# Altium project Bluetooth_NRF.PrjPCB
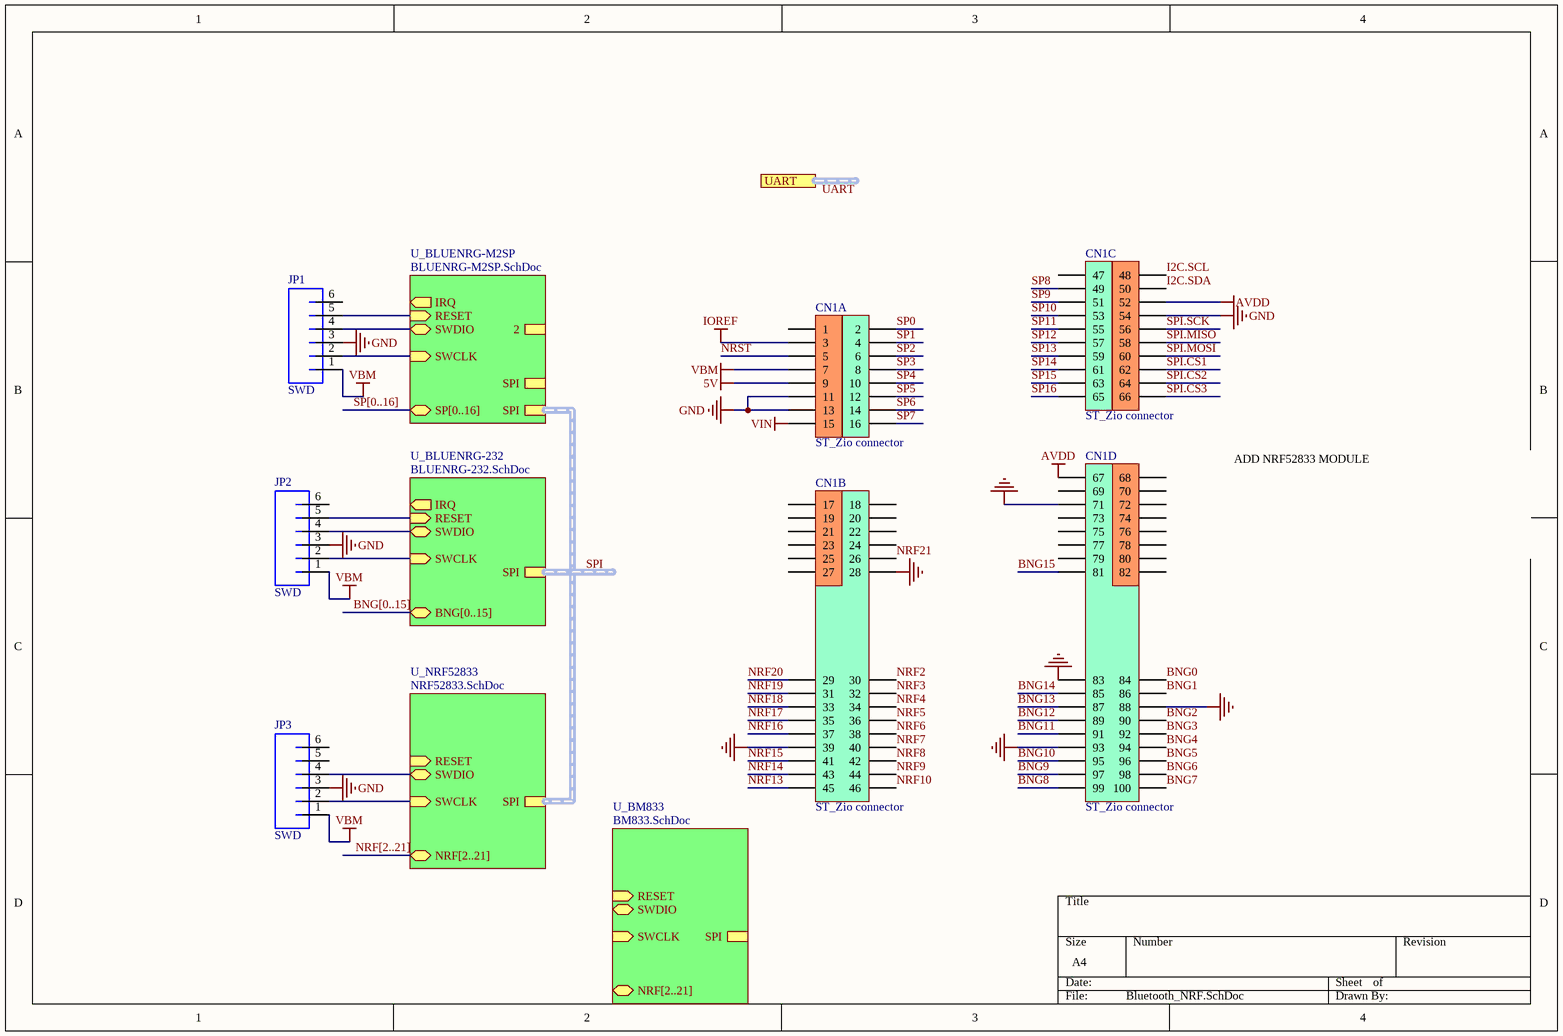
[diagram p0: Bluetooth_NRF.SchDoc]
3 sheets, 29 parts. Net scope: hierarchical (ports join the sheet entries above them; power ports are global).
Board file: Bluetooth_NRF.PcbDoc
Sheets:
  Bluetooth_NRF.SchDoc
    U_NRF52833 = NRF52833.SchDoc
    U_BM833 = BM833.SchDoc

## Sheet Bluetooth_NRF.SchDoc
size A4

### Parts
CN1  ST_Zio connector  [ST_Zio]  (parts A,B,C,D of 4)
JP1  SWD  [MOLEX_5045_6]
JP2  SWD  [MOLEX_5045_6]
JP3  SWD  [MOLEX_5045_6]

### Sub-sheets
U_BLUENRG-232 = BLUENRG-232.SchDoc (file not in this document): BNG[0..15] (bidir), IRQ (out), RESET (in), SWCLK (in), SWDIO (bidir), SPI (harness SPI)
U_BLUENRG-M2SP = BLUENRG-M2SP.SchDoc (file not in this document): IRQ (out), RESET (in), 2, SWCLK (in), SWDIO (bidir), SPI, SPI (harness SPI), SP[0..16] (bidir)
U_BM833 = BM833.SchDoc: NRF[2..21] (bidir), RESET (in), SWCLK (in), SWDIO (bidir), SPI (harness SPI)
U_NRF52833 = NRF52833.SchDoc: NRF[2..21] (bidir), RESET (in), SWCLK (in), SWDIO (bidir), SPI (harness SPI)

### Ports
UART (harness USART2)

### Nets
5V: CN1.9
AVDD: CN1.52 CN1.67
GND: CN1.11 CN1.13 CN1.28 CN1.39 CN1.54 CN1.71 CN1.83 CN1.88 CN1.93 JP1.3 JP2.3 JP3.3
IOREF: CN1.3
VBM: CN1.7 JP1.1 JP2.1 JP3.1
VIN: CN1.15
BNG0: CN1.84
BNG1: CN1.86
BNG2: CN1.90
BNG3: CN1.92
BNG4: CN1.94
BNG5: CN1.96
BNG6: CN1.98
BNG7: CN1.100
BNG8: CN1.99
BNG9: CN1.97
BNG10: CN1.95
BNG11: CN1.91
BNG12: CN1.89
BNG13: CN1.87
BNG14: CN1.85
BNG15: CN1.81
I2C.SCL: CN1.48
I2C.SDA: CN1.50
NRF2: CN1.30
NRF3: CN1.32
NRF4: CN1.34
NRF5: CN1.36
NRF6: CN1.38
NRF7: CN1.40
NRF8: CN1.42
NRF9: CN1.44
NRF10: CN1.46
NRF13: CN1.45
NRF14: CN1.43
NRF15: CN1.41
NRF16: CN1.37
NRF17: CN1.35
NRF18: CN1.33
NRF19: CN1.31
NRF20: CN1.29
NRF21: CN1.26
NRST: CN1.5
SP0: CN1.2
SP1: CN1.4
SP2: CN1.6
SP3: CN1.8
SP4: CN1.10
SP5: CN1.12
SP6: CN1.14
SP7: CN1.16
SP8: CN1.49
SP9: CN1.51
SP10: CN1.53
SP11: CN1.55
SP12: CN1.57
SP13: CN1.59
SP14: CN1.61
SP15: CN1.63
SP16: CN1.65
SPI.CS1: CN1.62
SPI.CS2: CN1.64
SPI.CS3: CN1.66
SPI.MISO: CN1.58
SPI.MOSI: CN1.60
SPI.SCK: CN1.56
NetJP1_2: JP1.2 ; sheet U_BLUENRG-M2SP/SWCLK
NetJP1_4: JP1.4 ; sheet U_BLUENRG-M2SP/SWDIO
NetJP1_5: JP1.5 ; sheet U_BLUENRG-M2SP/RESET
NetJP2_2: JP2.2 ; sheet U_BLUENRG-232/SWCLK
NetJP2_4: JP2.4 ; sheet U_BLUENRG-232/SWDIO
NetJP2_5: JP2.5 ; sheet U_BLUENRG-232/RESET
NetJP3_2: JP3.2 ; sheet U_NRF52833/SWCLK
NetJP3_4: JP3.4 ; sheet U_NRF52833/SWDIO

Not connected (* = marked no-connect by the designer): CN1 1 17 18 19 20 21 22 23 24 25 27 47 68 69 70 72 73 74 75 76 77 78 79 80 82; JP1 6; JP2 6; JP3 5 6

### Buses and harness runs
bus BNG[0..15] = sheet U_BLUENRG-232/BNG[0..15]
bus NRF[2..21] = sheet U_NRF52833/NRF[2..21]
bus SP[0..16] = sheet U_BLUENRG-M2SP/SP[0..16]
harness SPI = sheet U_BLUENRG-232/SPI = sheet U_BLUENRG-M2SP/SPI = sheet U_NRF52833/SPI
harness UART = port UART

### Notes on the sheet
- ADD NRF52833 MODULE

### Library data of the parts
JP1-JP3 = MOLEX_5045_6: PartNumber: B6B-PH-K-S(LF)(SN); Manufacturer: JST Sales America Inc.; PackageReference: JST-PH; Mounting Technology: Through Hole

## Sheet NRF52833.SchDoc
size A4
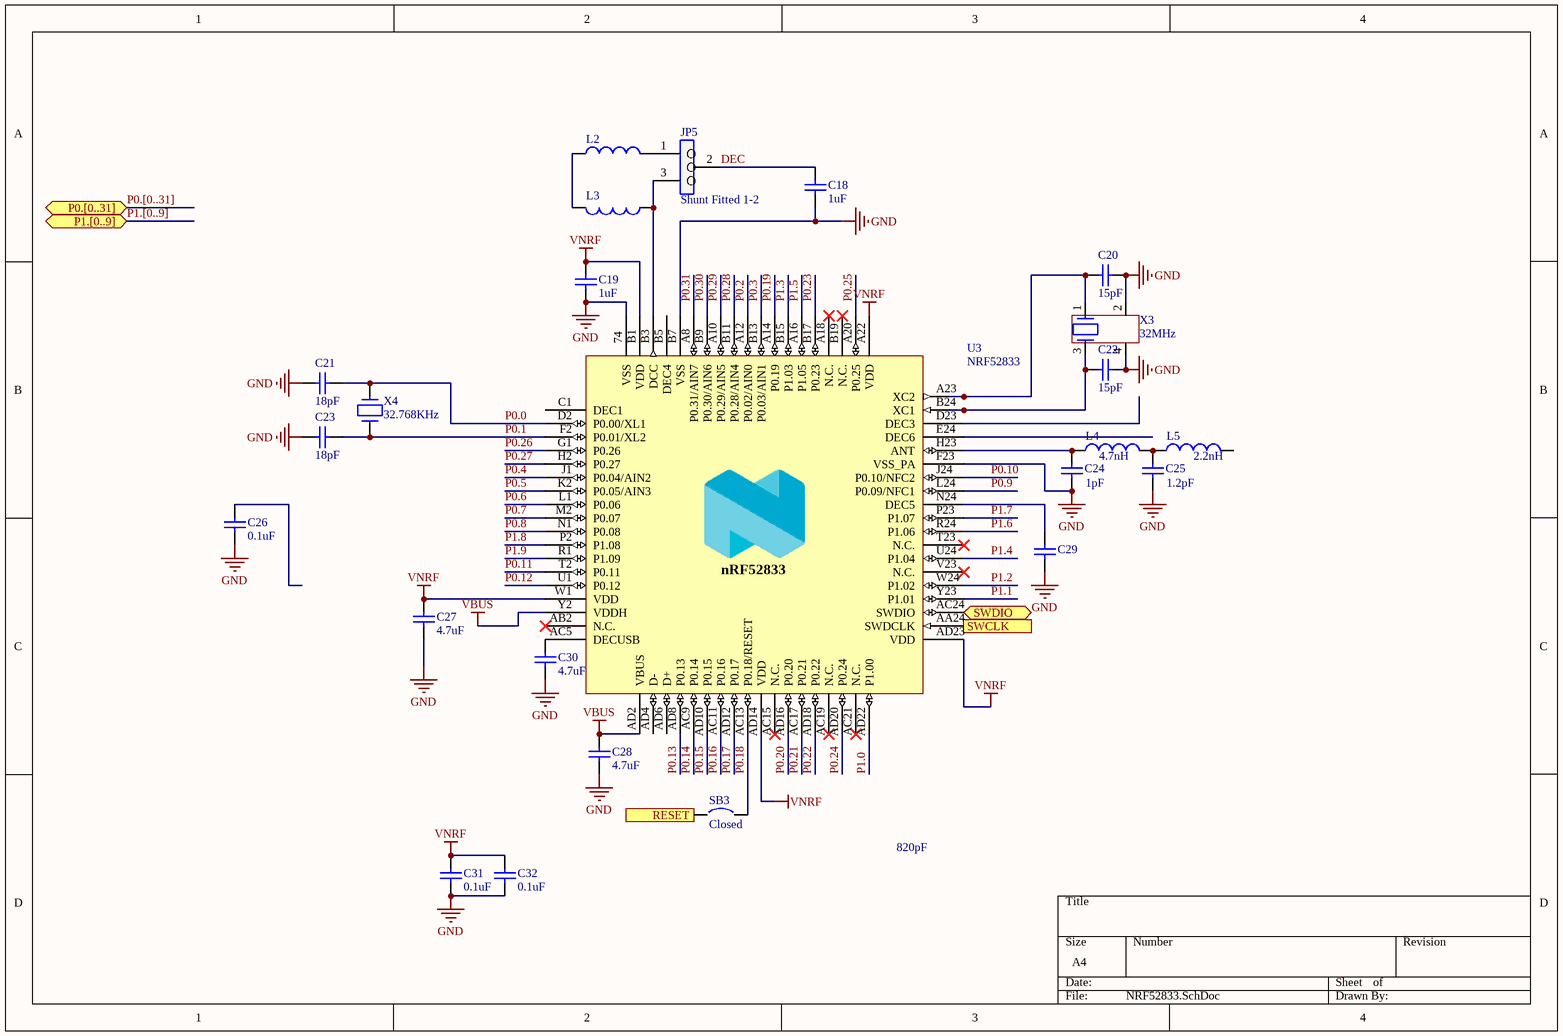
[diagram p1: NRF52833.SchDoc]

### Parts
C18  value 1uF  [C0603[1608X92]]  (hidden comment: 1uF 6.3V 0603)
C19  value 1uF  [C0603[1608X92]]  (hidden comment: 1uF 6.3V 0603)
C20  value 15pF  [C0603[1608X92]]  (hidden comment: 15pF 50V 0603)
C21  value 18pF  [C0603[1608X92]]  (hidden comment: 18pF 50V 0603)
C22  value 15pF  [C0603[1608X92]]  (hidden comment: 15pF 50V 0603)
C23  value 18pF  [C0603[1608X92]]  (hidden comment: 18pF 50V 0603)
C24  CAPACITOR 0603  [C0603[1608X92]]  (value not drawn)
C25  CAPACITOR 0603  [C0603[1608X92]]  (value not drawn)
C26  value 0.1uF  [C0603[1608X92]]  (hidden comment: 0.1uF 16V 0603)
C27  value 4.7uF  [C0603[1608X92]]  (hidden comment: 4.7uF 16V 0603)
C28  value 4.7uF  [C0603[1608X92]]  (hidden comment: 4.7uF 16V 0603)
C29  CAPACITOR 0603  [C0603[1608X92]]  (value not drawn)
C30  value 4.7uF  [C0603[1608X92]]  (hidden comment: 4.7uF 16V 0603)
C31  value 0.1uF  [C0603[1608X92]]  (hidden comment: 0.1uF 16V 0603)
C32  value 0.1uF  [C0603[1608X92]]  (hidden comment: 0.1uF 16V 0603)
JP5  value Shunt Fitted 1-2  [HDR1X3]  (hidden comment: Jumper_Header 3x1 Fitted 1-2)
L2  INDUCTOR 0603  [IND0603]  (value not drawn)
L3  INDUCTOR 0603  [IND0603]  (value not drawn)
L4  INDUCTOR 0603  [IND0603]  (value not drawn)
L5  INDUCTOR 0603  [IND0603]  (value not drawn)
SB3  Closed  [SB_0603]
U3  NRF52833  [AQFN-73]
X3  value 32MHz  [4-SMD]  (hidden comment: NX2016SA 32MHz)
X4  value 32.768KHz  [2-SMD]  (hidden comment: NX3215SA 32.768KHz)

### Ports
P0.[0..31] (bidir), P1.[0..9] (bidir), RESET (in), SWCLK (in), SWDIO (bidir)

### Nets
GND: C18.1 C19.1 C20.1 C21.2 C22.1 C23.2 C24.1 C25.1 C26.2 C27.1 C28.1 C29.1 C30.1 C31.2 C32.2 U3.74(VSS) U3.B7(VSS) U3.F23(VSS_PA) X3.2 X3.4
VBUS: C28.2 U3.AD2(VBUS) U3.Y2(VDDH)
VNRF: C19.2 C27.2 C31.1 C32.1 U3.A22(VDD) U3.AD14(VDD) U3.AD23(VDD) U3.B1(VDD) U3.W1(VDD)
DEC: C18.2 JP5.2
P0.0: C21.1 U3.D2(P0.00/XL1) X4.2(X2)
P0.1: C23.1 U3.F2(P0.01/XL2) X4.1(X1)
P0.2: U3.A12(P0.02/AIN0)
P0.3: U3.B13(P0.03/AIN1)
P0.4: U3.J1(P0.04/AIN2)
P0.5: U3.K2(P0.05/AIN3)
P0.6: U3.L1(P0.06)
P0.7: U3.M2(P0.07)
P0.8: U3.N1(P0.08)
P0.9: U3.L24(P0.09/NFC1)
P0.10: U3.J24(P0.10/NFC2)
P0.11: U3.T2(P0.11)
P0.12: U3.U1(P0.12)
P0.13: U3.AD8(P0.13)
P0.14: U3.AC9(P0.14)
P0.15: U3.AD10(P0.15)
P0.16: U3.AC11(P0.16)
P0.17: U3.AD12(P0.17)
P0.18: SB3.2 U3.AC13(P0.18/RESET)
P0.19: U3.A14(P0.19)
P0.20: U3.AD16(P0.20)
P0.21: U3.AC17(P0.21)
P0.22: U3.AD18(P0.22)
P0.23: U3.B17(P0.23)
P0.24: U3.AD20(P0.24)
P0.25: U3.A20(P0.25)
P0.26: U3.G1(P0.26)
P0.27: U3.H2(P0.27)
P0.28: U3.B11(P0.28/AIN4)
P0.29: U3.A10(P0.29/AIN5)
P0.30: U3.B9(P0.30/AIN6)
P0.31: U3.A8(P0.31/AIN7)
P1.0: U3.AD22(P1.00)
P1.1: U3.Y23(P1.01)
P1.2: U3.W24(P1.02)
P1.3: U3.B15(P1.03)
P1.4: U3.U24(P1.04)
P1.5: U3.A16(P1.05)
P1.6: U3.R24(P1.06)
P1.7: U3.P23(P1.07)
P1.8: U3.P2(P1.08)
P1.9: U3.R1(P1.09)
NetC20_2: C20.2 U3.A23(XC2) X3.1
NetC22_2: C22.2 U3.B24(XC1) X3.3
NetC24_2: C24.2 L4.1 U3.H23(ANT)
NetC25_2: C25.2 L4.2 L5.1
NetC29_2: C29.2 U3.N24(DEC5)
NetC30_2: C30.2 U3.AC5(DECUSB)
NetJP3_2: U3.AA24(SWDCLK) ; port SWCLK
NetJP3_4: U3.AC24(SWDIO) ; port SWDIO
NetJP5_1: JP5.1 L2.2
NetJP5_3: JP5.3 L3.1 U3.B3(DCC)
NetL2_1: L2.1 L3.2
NetSB3_1: SB3.1 ; port RESET

Not connected (* = marked no-connect by the designer): C26 1; L5 2; U3 A18(N.C.)* AB2(N.C.)* AC15(N.C.)* AC19(N.C.)* AC21(N.C.)* AD4(D-) AD6(D+) B5(DEC4) B19(N.C.)* C1(DEC1) D23(DEC3) E24(DEC6) T23(N.C.)* V23(N.C.)*

### Buses and harness runs
bus P0.[0..31] = port P0.[0..31]
bus P1.[0..9] = port P1.[0..9]

### Notes on the sheet
- (near C24) 1pF
- (near L4) 4.7nH
- (near C25) 1.2pF
- (near L5) 2.2nH
- 820pF
- (in symbol NRF52833) nRF52833

### Library data of the parts
C18 C19 = CAP_1uF_6.3V_0603_10%: 1uF 6.3V 10% 0603 (1608 Metric); PartNumber: GRM188R60J105KA01D; Manufacturer: Murata; TemperatureCoefficient: X5R; Mounting Technology: Surface Mount; PackageReference: 0603; PackageDescription: 0603 (1608 Metric); Voltage: 6.3V; Tolerance: 10%
C20 C22 = CAP_15pF_50V_0603_1%: 15pF 50V 1% 0603 (1608 Metric); PartNumber: 06035A150FAT2A; Manufacturer: AVX Corporation; TemperatureCoefficient: C0G; Mounting Technology: Surface Mount; PackageReference: 0603; PackageDescription: 0603 (1608 Metric); Voltage: 50V; Tolerance: 1%
C21 C23 = CAP_18pF_50V_0603_1%: 18pF 50V 1% 0603 (1608 Metric); PartNumber: 06035A180FAT2A; Manufacturer: AVX Corporation; TemperatureCoefficient: C0G; Mounting Technology: Surface Mount; PackageReference: 0603; PackageDescription: 0603 (1608 Metric); Voltage: 50V; Tolerance: 1%
C24 C25 C29 = CAP 0603: Empty CAPACITOR 0603 (1608 Metric); Mounting Technology: Surface Mount; PackageReference: 0603; PackageDescription: 0603 (1608 Metric)
C26 C31 C32 = CAP_0.1uF_16V_0603_10%: 0.1uF 16V 10% 0603 (1608 Metric); PartNumber: GCM188R71C104KA37D; Manufacturer: Murata; TemperatureCoefficient: X7R; Mounting Technology: Surface Mount; PackageReference: 0603; PackageDescription: 0603 (1608 Metric); Voltage: 16V; Tolerance: 10%
C27 C28 C30 = CAP_4.7uF_16V_0603_10%: 4.7uF 16V 10% 0603 (1608 Metric); PartNumber: GRM188R61A475KE15D; Manufacturer: Murata; TemperatureCoefficient: X5R; Mounting Technology: Surface Mount; PackageReference: 0603; PackageDescription: 0603 (1608 Metric); Voltage: 16V; Tolerance: 10%
JP5 = Jumper_Header 3x1 Fitted 1-2: Header, 3x1, 2,54mm, VR, TH, Height 5.84mm/2.54mm - Shunt Fitted 1-2 by default; Internal_Part_Number: MCD-00684; Part_Type: Connector; Manufacturer_Part_Number: TSW-103-07-F-S; Manufacturer: SAMTEC; Provided_By: SUBCO; Status: Released; ComponentLink1Description: Datasheet; ComponentLink1URL: http://tunmcdsvn.tun.st.com/Component_Datasheet_Library/Trunk/Connectors/Samtec_TSW-HTSW-series; ECCN_US: n/a; ECCN_EU: n/a
L2-L5 = IND 0603: Empty INDUCTOR 0603; PackageReference: 0603; PackageDescription: 0603 (1608 metric); Mounting Technology: Surface Mount
SB3 = Circuit Breaker_close: Circuit Breaker; Published: 24-Mar-1999; Revision: July-2002: Re-released for DXP Platform.; Publisher: Altium Limited
U3 = NRF52833: Multi-protocol Bluetooth Low Energy, IEEE 802.15.4, ANT and 2.4GHz proprietary system-on-chip; PartNumber: nRF52833-QIAA; Manufacturer: Nordic Semiconductor; PackageReference: AQFN-73; Mounting Technology: Surface Mount
X3 = NX2016SA 32MHz: Crystal 32MHz, 6pF, +-10ppm, 60ohms max, SMD; PartNumber: NX2016SA-32MHZ-EXS00A-CS07977; Manufacturer: NDK; Mounting Technology: Surface Mount; PackageReference: 4-SMD; Type: Crystal_Osc
X4 = NX3215SA 32.768KHz: Crystal 32.768kHz, 6pF, +-20ppm, 50Kohms max, SMD; PartNumber: NX3215SA-32.768KHz-EXS00A-MU00525; Manufacturer: NDK; Mounting Technology: Surface Mount; PackageReference: 2-SMD; Type: Crystal_Osc

## Sheet BM833.SchDoc
size A4
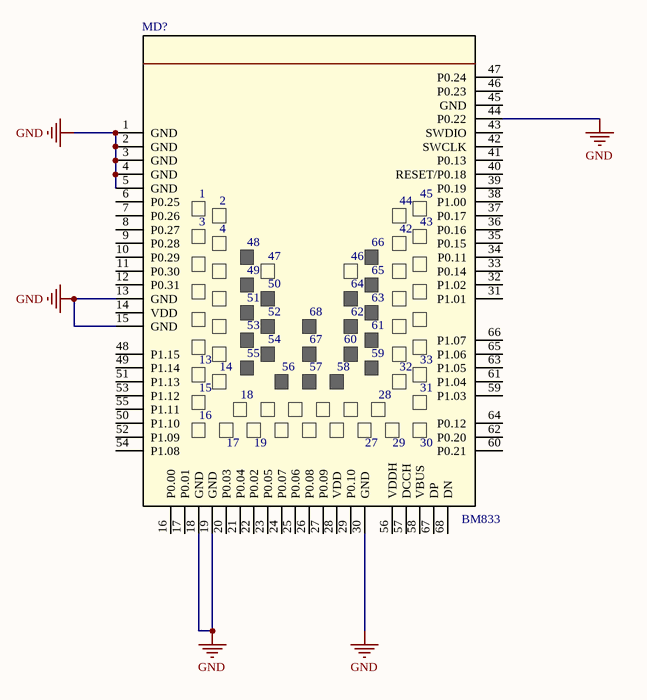
[diagram p2: BM833.SchDoc]

### Parts
MD?  BM833  [BM833]

### Nets
GND: MD?.1(GND) MD?.2(GND) MD?.3(GND) MD?.4(GND) MD?.5(GND) MD?.13(GND) MD?.15(GND) MD?.18(GND) MD?.19(GND) MD?.30(GND) MD?.44(P0.22)

Not connected (* = marked no-connect by the designer): MD? 6(P0.25) 7(P0.26) 8(P0.27) 9(P0.28) 10(P0.29) 11(P0.30) 12(P0.31) 14(VDD) 16(P0.00) 17(P0.01) 20(P0.03) 21(P0.04) 22(P0.02) 23(P0.05) 24(P0.07) 25(P0.06) 26(P0.08) 27(P0.09) 28(VDD) 29(P0.10) 31(P1.01) 32(P1.02) 33(P0.14) 34(P0.11) 35(P0.15) 36(P0.16) 37(P0.17) 38(P1.00) 39(P0.19) 40(RESET/P0.18) 41(P0.13) 42(SWCLK) 43(SWDIO) 45(GND) 46(P0.23) 47(P0.24) 48(P1.15) 49(P1.14) 50(P1.10) 51(P1.13) 52(P1.09) 53(P1.12) 54(P1.08) 55(P1.11) 56(VDDH) 57(DCCH) 58(VBUS) 59(P1.03) 60(P0.21) 61(P1.04) 62(P0.20) 63(P1.05) 64(P0.12) 65(P1.06) 66(P1.07) 67(DP) 68(DN)

### Library data of the parts
MD? = BM833: ultra low power Bluetooth Low Energy (BLE) modules using Nordic nRF52 SoC.  PCB trace Antenna; Manufacturer: Fanstel; PartNumber: BM833

## Nets that join several sheets
GND: Bluetooth_NRF (12 pins), NRF52833 (20 pins), BM833 (11 pins)
NetJP3_2: Bluetooth_NRF (JP3.2), NRF52833 (U3.AA24)
NetJP3_4: Bluetooth_NRF (JP3.4), NRF52833 (U3.AC24)